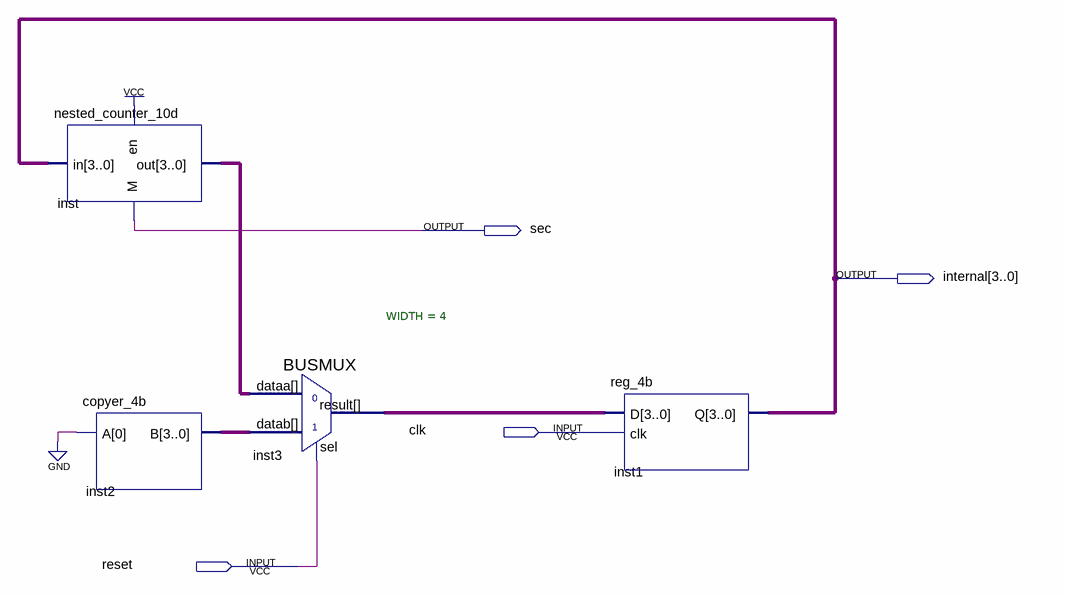
[diagram p0: schematic sheet]
// Quartus schematic nested_counter_10t.bdf as structural Verilog: 4 symbols, 4 pins
module nested_counter_10t (
  input  clk,
  input  reset,
  output sec,
  output [3:0] internal
);

  wire [3:0] inst2_b, inst3_result, inst_out;

  nested_counter_10d inst (.en(1'b1), .in(internal), .out(inst_out), .M(sec));
  copyer_4b inst2 (.A(1'b0), .B(inst2_b));
  BUSMUX #(.WIDTH(4)) inst3 (.datab(inst2_b), .sel(reset), .dataa(inst_out), .result(inst3_result));
  reg_4b inst1 (.D(inst3_result), .clk(clk), .Q(internal));
endmodule
